# Altium schematic sheet toplevel_os.SchDoc: SION Top Level (OS version)
size A4; Organization: UNSW Solar Racing Team; Address3: UNSW; Address4: Sydney NSW 2052; Address2: Electrical Engineering; Address1: Room 342
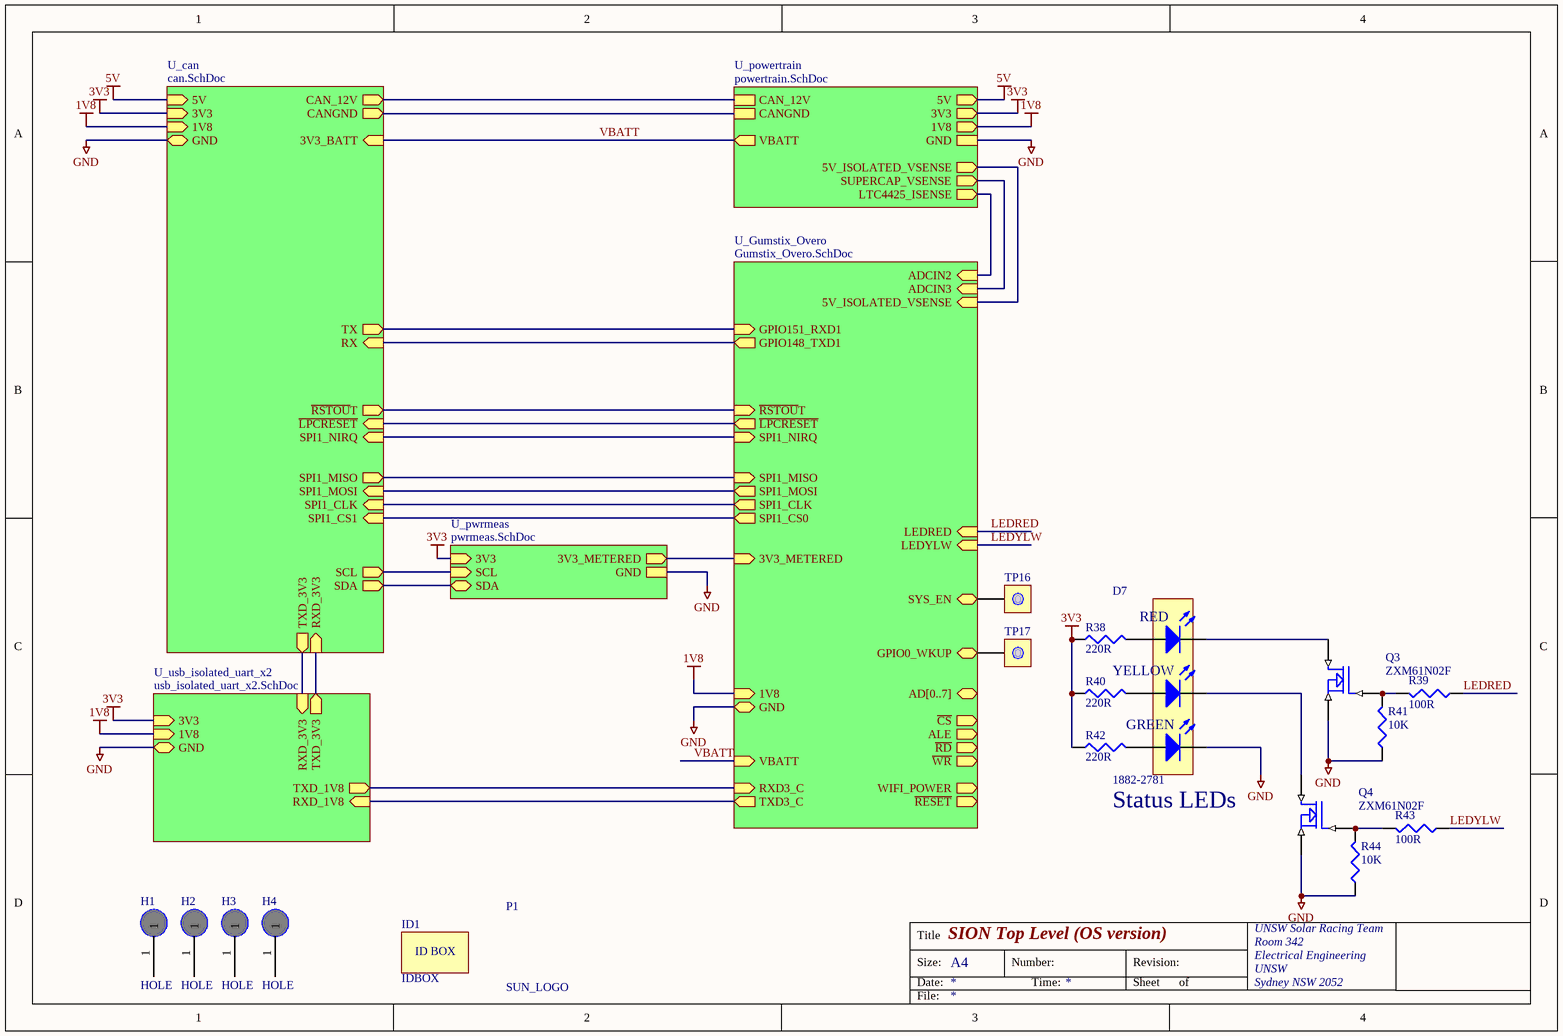
[diagram p0: toplevel_os.SchDoc]

## Parts
D7  1882-2781  [LED_TRILEVEL]
H1  HOLE  [#6]
H2  HOLE  [#6]
H3  HOLE  [#6]
H4  HOLE  [#6]
ID1  IDBOX  [IDBOX]
P1  SUN_LOGO  [SUNSWIFTLOGO]
Q3  ZXM61N02F  [SOT23-3]
Q4  ZXM61N02F  [SOT23-3]
R38  220R  [0603]
R39  100R  [0603]
R40  220R  [0603]
R41  10K  [0603]
R42  220R  [0603]
R43  100R  [0603]
R44  10K  [0603]
TP16  SYS_EN  [TESTPOINT]  (value not drawn)
TP17  WKUP  [TESTPOINT]  (value not drawn)

## Sub-sheets
U_can = can.SchDoc: CAN_12V (out), CANGND (out), 3V3 (in), 1V8 (in), 5V (in), GND, SPI1_MISO (out), SPI1_MOSI (in), SPI1_CLK (in), SPI1_CS1 (in), SPI1_NIRQ (in), TXD_3V3 (out), RXD_3V3 (in), 3V3_BATT (in), ~{RSTOU}T (out), ~{LPCRESET} (in), SDA (out), SCL (out), TX (out), RX (in)
U_Gumstix_Overo = Gumstix_Overo.SchDoc: SPI1_MISO (in), SPI1_MOSI (out), SPI1_CLK (out), SPI1_NIRQ (in), SPI1_CS0 (out), SYS_EN (bidir), RXD3_C (in), TXD3_C (out), ADCIN3 (in), ADCIN2 (in), GPIO148_TXD1 (out), GPIO151_RXD1 (in), GPIO0_WKUP (bidir), AD[0..7] (bidir), ~{CS} (out), ALE (out), ~{RD} (out), ~{WR} (out), 3V3_METERED (in), 1V8 (in), GND, ~{RSTOU}T (in), ~{LPCRESET} (out), ~{RESET} (out), 5V_ISOLATED_VSENSE (in), WIFI_POWER (out), LEDRED (in), LEDYLW (in), VBATT (in)
U_powertrain = powertrain.SchDoc: GND, 5V_ISOLATED_VSENSE (out), SUPERCAP_VSENSE (out), CAN_12V, CANGND, 3V3 (out), LTC4425_ISENSE (out), 5V (out), 1V8 (out), VBATT (out)
U_pwrmeas = pwrmeas.SchDoc: 3V3 (in), 3V3_METERED (out), SCL (in), SDA (bidir), GND
U_usb_isolated_uart_x2 = usb_isolated_uart_x2.SchDoc: TXD_3V3 (out), RXD_3V3 (in), 3V3 (in), 1V8 (in), TXD_1V8 (out), RXD_1V8 (in), GND (bidir)

## Nets
1V8: sheet U_powertrain/1V8, sheet U_can/1V8, sheet U_usb_isolated_uart_x2/1V8, sheet U_Gumstix_Overo/1V8
3V3: R38.1 R40.1 R42.1 ; sheet U_powertrain/3V3, sheet U_can/3V3, sheet U_usb_isolated_uart_x2/3V3, sheet U_pwrmeas/3V3
5V: sheet U_powertrain/5V, sheet U_can/5V
GND: D7.1(K) Q3.2(S) Q4.2(S) R41.1 R44.1 ; sheet U_powertrain/GND, sheet U_can/GND, sheet U_usb_isolated_uart_x2/GND, sheet U_Gumstix_Overo/GND, sheet U_pwrmeas/GND
LEDRED: R39.1 ; sheet U_Gumstix_Overo/LEDRED
LEDYLW: R43.1 ; sheet U_Gumstix_Overo/LEDYLW
VBATT: sheet U_powertrain/VBATT, sheet U_can/3V3_BATT, sheet U_Gumstix_Overo/VBATT
NetD7_2: D7.2(K) Q4.3(D)
NetD7_3: D7.3(K) Q3.3(D)
NetD7_4: D7.4(A) R38.2
NetD7_5: D7.5(A) R40.2
NetD7_6: D7.6(A) R42.2
NetQ3_1: Q3.1(G) R39.2 R41.2
NetQ4_1: Q4.1(G) R43.2 R44.2
NetTP16_0: TP16.0(TP) ; sheet U_Gumstix_Overo/SYS_EN
NetTP17_0: TP17.0(TP) ; sheet U_Gumstix_Overo/GPIO0_WKUP
(unnamed): sheet U_powertrain/5V_ISOLATED_VSENSE, sheet U_Gumstix_Overo/5V_ISOLATED_VSENSE
(unnamed): sheet U_powertrain/SUPERCAP_VSENSE, sheet U_Gumstix_Overo/ADCIN3
(unnamed): sheet U_powertrain/CAN_12V, sheet U_can/CAN_12V
(unnamed): sheet U_powertrain/CANGND, sheet U_can/CANGND
(unnamed): sheet U_powertrain/LTC4425_ISENSE, sheet U_Gumstix_Overo/ADCIN2
(unnamed): sheet U_can/SPI1_MISO, sheet U_Gumstix_Overo/SPI1_MISO
(unnamed): sheet U_can/SPI1_MOSI, sheet U_Gumstix_Overo/SPI1_MOSI
(unnamed): sheet U_can/SPI1_CLK, sheet U_Gumstix_Overo/SPI1_CLK
(unnamed): sheet U_can/SPI1_CS1, sheet U_Gumstix_Overo/SPI1_CS0
(unnamed): sheet U_can/SPI1_NIRQ, sheet U_Gumstix_Overo/SPI1_NIRQ
(unnamed): sheet U_can/TXD_3V3, sheet U_usb_isolated_uart_x2/RXD_3V3
(unnamed): sheet U_can/RXD_3V3, sheet U_usb_isolated_uart_x2/TXD_3V3
(unnamed): sheet U_can/~{RSTOU}T, sheet U_Gumstix_Overo/~{RSTOU}T
(unnamed): sheet U_can/~{LPCRESET}, sheet U_Gumstix_Overo/~{LPCRESET}
(unnamed): sheet U_can/SDA, sheet U_pwrmeas/SDA
(unnamed): sheet U_can/SCL, sheet U_pwrmeas/SCL
(unnamed): sheet U_can/TX, sheet U_Gumstix_Overo/GPIO151_RXD1
(unnamed): sheet U_can/RX, sheet U_Gumstix_Overo/GPIO148_TXD1
(unnamed): sheet U_usb_isolated_uart_x2/TXD_1V8, sheet U_Gumstix_Overo/RXD3_C
(unnamed): sheet U_usb_isolated_uart_x2/RXD_1V8, sheet U_Gumstix_Overo/TXD3_C
(unnamed): sheet U_Gumstix_Overo/3V3_METERED, sheet U_pwrmeas/3V3_METERED

Not connected (* = marked no-connect by the designer): H1 1; H2 1; H3 1; H4 1

## Notes on the sheet
- Status LEDs
- Title
- Size:
- Date:
- A4
- Number:
- Time:
- Revision:
- Sheet
- of
- File:
- (in symbol IDBOX) ID BOX
- (in symbol LED-TRILEVEL) RED; YELLOW; GREEN

## Library data of the parts
D7 = LED-TRILEVEL: Three level LED; Farnell: 1461596; Digikey: 350-1751-ND; DigikeyPrice: 3.22; FarnellPrice: 4.56
Q3 Q4 = ZXM61N02F: 1.7A, 20V N-Channel Enhancement mode FET; Digikey: ZXM61N02FCT-ND; DigikeyPrice: 0.66; Farnell: 9525270; FarnellPrice: 1.35
R38-R44 = RES1: Resistor; Order#: 9331697; Supplier: Farnell; Price: 0.05
TP16 TP17 = TEST: TEST POINT